# Altium schematic sheet SIM7020.SchDoc
size A4
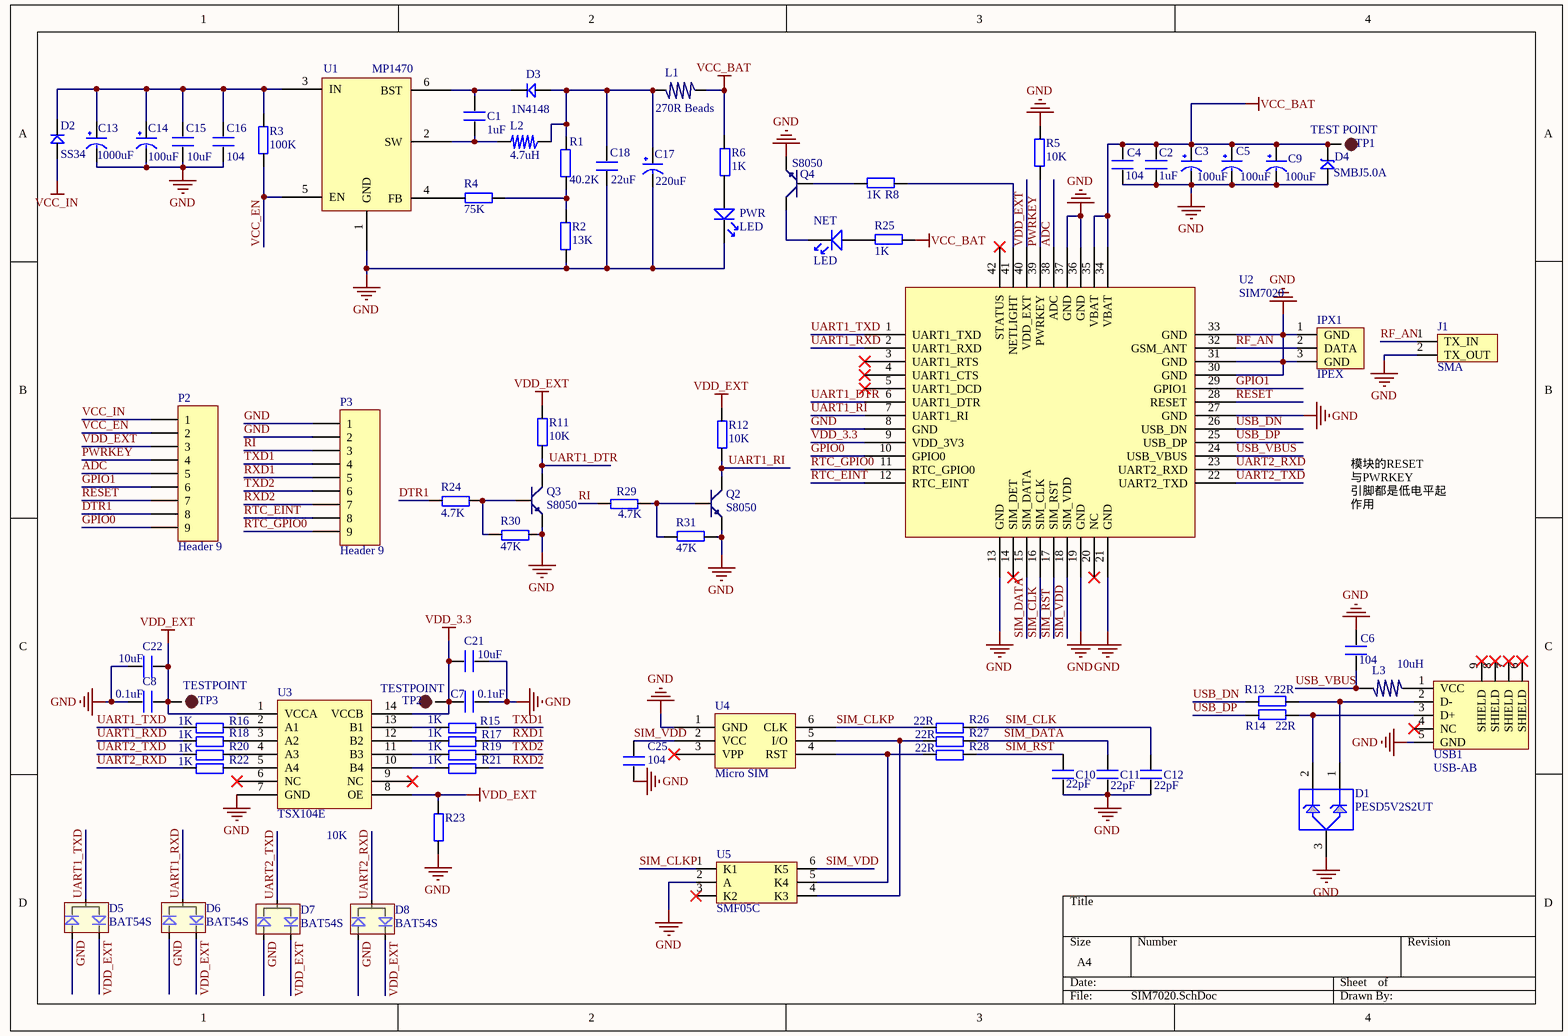
[diagram p0: SIM7020.SchDoc]

## Parts
C1  1uF  [0603P]
C2  1uF  [0603P]
C3  100uF  [C3528]
C4  104  [0603P]
C5  100uF  [C3528]
C6  104  [0603P]
C7  0.1uF  [0603P]
C8  0.1uF  [0603P]
C9  100uF  [C3528]
C10  22pF  [0402]
C11  22pF  [0402]
C12  22pF  [0402]
C13  1000uF  [CAP2.54]
C14  100uF  [C3528]
C15  10uF  [0805]
C16  104  [0603P]
C17  220uF  [CC6.56.5]
C18  22uF  [1206]
C21  10uF  [0603P]
C22  10uF  [0603P]
C25  104  [0603P]
D1  value PESD5V2S2UT  [SOT-23]  (hidden comment: ESD-3)
D2  SS34  [DIODE_3*5.3]
D3  1N4148  [DIODE_SOP]
D4  SMBJ5.0A  [SMBJ]
D5  BAT54S  [SOT-23]
D6  BAT54S  [SOT-23]
D7  BAT54S  [SOT-23]
D8  BAT54S  [SOT-23]
IPX1  IPEX  [IPEX]
J1  SMA  [SMA-2]
L1  270R Beads  [1206]
L2  4.7uH  [L_CD43]
L3  10uH  [0805]
NET  LED  [SMDLED]
P2  Header 9  [HDR1X9]
P3  Header 9  [HDR1X9]
PWR  LED  [SMDLED]
Q2  S8050  [SOT-23R]
Q3  S8050  [SOT-23R]
Q4  S8050  [SOT-23R]
R1  40.2K  [0603P]
R2  13K  [0603P]
R3  100K  [0603P]
R4  75K  [0603P]
R5  10K  [0603P]
R6  1K  [0603P]
R8  1K  [0603P]
R11  10K  [0603P]
R12  10K  [0603P]
R13  22R  [0603P]
R14  22R  [0603P]
R15  1K  [0603P]
R16  1K  [0603P]
R17  1K  [0603P]
R18  1K  [0603P]
R19  1K  [0603P]
R20  1K  [0603P]
R21  1K  [0603P]
R22  1K  [0603P]
R23  10K  [0603P]
R24  4.7K  [0603P]
R25  1K  [0603P]
R26  22R  [0603P]
R27  22R  [0603P]
R28  22R  [0603P]
R29  4.7K  [0603P]
R30  47K  [0603P]
R31  47K  [0603P]
TP1  TEST POINT  [TP-1.5]
TP2  TESTPOINT  [TP-1.5]
TP3  TESTPOINT  [TP-1.5]
U1  MP1470  [SOP23-6 - duplicate1]
U2  SIM7020  [SIM7020]
U3  TSX104E  [TSX104E]
U4  Micro SIM  [Micro SIM]
U5  SMF05C  [SMF05C]
USB1  USB-AB  [USB_AB]

## Nets
GND: C2.1 C3.2(GND) C4.1 C5.2(GND) C6.2 C7.2 C8.2 C9.2(GND) C10.2 C11.1 C12.1 C13.2(GND) C14.2(GND) C15.2 C16.1 C17.2(GND) C18.1 C21.2 C22.1 C25.1 D1.3 D4.1 D5.1 D6.1 D7.1 D8.1 IPX1.1(GND) IPX1.3(GND) J1.2(TX_OUT) P3.1 P3.2 PWR.2 Q2.1(E) Q3.1(E) Q4.1(E) R2.2 R5.1 R23.1 R30.2 R31.1 U1.1(GND) U2.8(GND) U2.13(GND) U2.19(GND) U2.21(GND) U2.27(GND) U2.30(GND) U2.31(GND) U2.33(GND) U2.36(GND) U2.37(GND) U3.7(GND) U4.1(GND) U5.2(A) USB1.5(GND)
VCC_BAT: C2.2 C3.1(VCC) C4.2 C5.1(VCC) C9.1(VCC) D4.2 L1.1 R6.2 R25.1 TP1.1 U2.34(VBAT) U2.35(VBAT)
VCC_IN: D2.1 P2.1
VDD_3.3: C7.1 C21.1 TP2.1 U2.9(VDD_3V3) U3.14(VCCB)
VDD_EXT: C8.1 C22.2 D5.2 D6.2 D7.2 D8.2 P2.3 R11.2 R12.2 R23.2 TP3.1 U2.40(VDD_EXT) U3.1(VCCA) U3.8(OE)
ADC: P2.5 U2.38(ADC)
DTR1: P2.8 R24.1
GPIO0: P2.9 U2.10(GPIO0)
GPIO1: P2.6 U2.29(GPIO1)
PWRKEY: P2.4 R5.2 U2.39(PWRKEY)
RESET: P2.7 U2.28(RESET)
RF_AN: IPX1.2(DATA) J1.1(TX_IN) U2.32(GSM_ANT)
RI: P3.3 R29.1
RTC_EINT: P3.8 U2.12(RTC_EINT)
RTC_GPIO0: P3.9 U2.11(RTC_GPIO0)
RXD1: P3.5 R17.2
RXD2: P3.7 R21.2
SIM_CLK: C12.2 R26.2 U2.16(SIM_CLK)
SIM_CLKP: R26.1 U4.6(CLK) U5.1(K1)
SIM_DATA: C11.2 R27.2 U2.15(SIM_DATA)
SIM_RST: C10.1 R28.2 U2.17(SIM_RST)
SIM_VDD: C25.2 U2.18(SIM_VDD) U4.2(VCC) U5.6(K5)
TXD1: P3.4 R15.2
TXD2: P3.6 R19.2
UART1_DTR: Q3.3(C) R11.1 U2.6(UART1_DTR)
UART1_RI: Q2.3(C) R12.1 U2.7(UART1_RI)
UART1_RXD: D6.3 R18.1 U2.2(UART1_RXD)
UART1_TXD: D5.3 R16.1 U2.1(UART1_TXD)
UART2_RXD: D8.3 R22.1 U2.23(UART2_RXD)
UART2_TXD: D7.3 R20.1 U2.22(UART2_TXD)
USB_DN: R13.2 U2.26(USB_DN)
USB_DP: R14.2 U2.25(USB_DP)
USB_VBUS: C6.1 L3.2 U2.24(USB_VBUS)
VCC_EN: P2.2 R3.2 U1.5(EN)
NetC1_1: C1.1 D3.2 U1.6(BST)
NetC1_2: C1.2 L2.2 U1.2(SW)
NetC13_1: C13.1(VCC) C14.1(VCC) C15.1 C16.2 D2.2 R3.1 U1.3(IN)
NetC17_1: C17.1(VCC) C18.2 D3.1 L1.2 L2.1 R1.1
NetD1_1: D1.1 R13.1 USB1.2(D-)
NetD1_2: D1.2 R14.1 USB1.3(D+)
NetL3_1: L3.1 USB1.1(VCC)
NetNET_1: NET.1 R25.2
NetNET_2: NET.2 Q4.3(C)
NetPWR_1: PWR.1 R6.1
NetQ2_2: Q2.2(B) R29.2 R31.2
NetQ3_2: Q3.2(B) R24.2 R30.1
NetQ4_2: Q4.2(B) R8.2
NetR1_2: R1.2 R2.1 R4.1
NetR4_2: R4.2 U1.4(FB)
NetR8_1: R8.1 U2.41(NETLIGHT)
NetR15_1: R15.1 U3.13(B1)
NetR16_2: R16.2 U3.2(A1)
NetR17_1: R17.1 U3.12(B2)
NetR18_2: R18.2 U3.3(A2)
NetR19_1: R19.1 U3.11(B3)
NetR20_2: R20.2 U3.4(A3)
NetR21_1: R21.1 U3.10(B4)
NetR22_2: R22.2 U3.5(A4)
NetR27_1: R27.1 U4.5(I/O) U5.4(K3)
NetR28_1: R28.1 U4.4(RST) U5.5(K4)

Not connected (* = marked no-connect by the designer): U2 3(UART1_RTS)* 4(UART1_CTS)* 5(UART1_DCD)* 14(SIM_DET)* 20(NC)* 42(STATUS)*; U3 6(NC)* 9(NC)*; U4 3(VPP)*; U5 3(K2)*; USB1 4(NC)* 6(SHIELD)* 7(SHIELD)* 8(SHIELD)* 9(SHIELD)*

## Notes on the sheet
- 模块的RESET
  与PWRKEY
  引脚都是低电平起作用
  默认输出3.3V高电平

## Library data of the parts
C1 C2 C4 C6-C8 C10-C12 C15 C16 C18 C21 C22 C25 = C
C3 C5 C9 C13 C14 C17 = CAP
D1 = ESD-3: PESD5V2S2UT,SOT-23,NXP; 物料代码: 1.05.10.0244; 名称: IC; 设备封装名称: SOT-23_PESD5V2S2UT; 贴片和直插: SMT; 封装: SOT-23; 厂商: NXP; 型号: PESD5V2S2UT; 器件优选方案: *; ComponentLink1Description: ErpDataInfo; ComponentLink1URL: http://erp.zlgmcu.com/ErpExt/ErpData/ListMateriel.aspx?pkey=1.05.10.0244
D2 = D: 1N4148
D3 = D
D4 = SMBJ: TVS
D5-D8 = BAT54S: 双肖特基二极管
IPX1 = IPEX: IPEX座
J1 = SMA-2
L1 L3 = L
L2 = L_SOP
P2 P3 = Header 9: Header, 9-Pin; LatestRevisionDate: 17-Jul-2002; LatestRevisionNote: Re-released for DXP Platform.; Publisher: Altium Limited
Q2-Q4 = NPN: 8050/BCW846/BCW847
R1-R6 R8 R11-R31 = R
TP1-TP3 = TEST-POINT: 测试点
U2 = SIM7020: NBloT
U5 = SMF05C: TVS
USB1 = USB-AB: MicroUSB